# Altium project LED Bar.PrjPCB
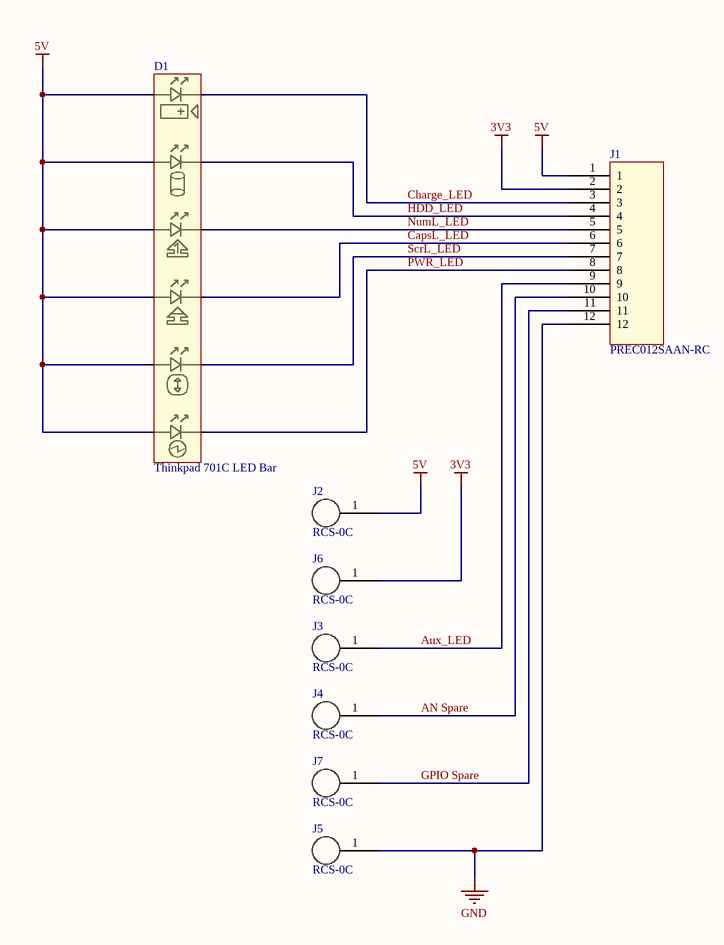
[diagram p0: LED Bar.SchDoc]
1 sheet, 8 parts. Net scope: global (net labels, ports and power ports of the same name join across sheets).
Board file: LED Bar.PcbDoc

## Sheet LED Bar.SchDoc
size B

### Parts
D1  Thinkpad 701C LED Bar  [TP701C LED Bar]
J1  PREC012SAAN-RC  [PREC012SAAN-RC]
J2  RCS-0C  [RCS-0C]
J3  RCS-0C  [RCS-0C]
J4  RCS-0C  [RCS-0C]
J5  RCS-0C  [RCS-0C]
J6  RCS-0C  [RCS-0C]
J7  RCS-0C  [RCS-0C]

### Nets
3V3: J1.2 J6.1
5V: D1.1 D1.3 D1.5 D1.7 D1.9 D1.11 J1.1 J2.1
GND: J1.12 J5.1
AN Spare: J1.10 J4.1
Aux_LED: J1.9 J3.1
CapsL_LED: D1.8 J1.6
Charge_LED: D1.2 J1.3
GPIO Spare: J1.11 J7.1
HDD_LED: D1.4 J1.4
NumL_LED: D1.6 J1.5
PWR_LED: D1.12 J1.8
ScrL_LED: D1.10 J1.7

### Library data of the parts
J1 = PREC012SAAN-RC: CONN HDR 12POS 0.1 TIN PCB